# EAGLE design control (EAGLE 7.1.0)
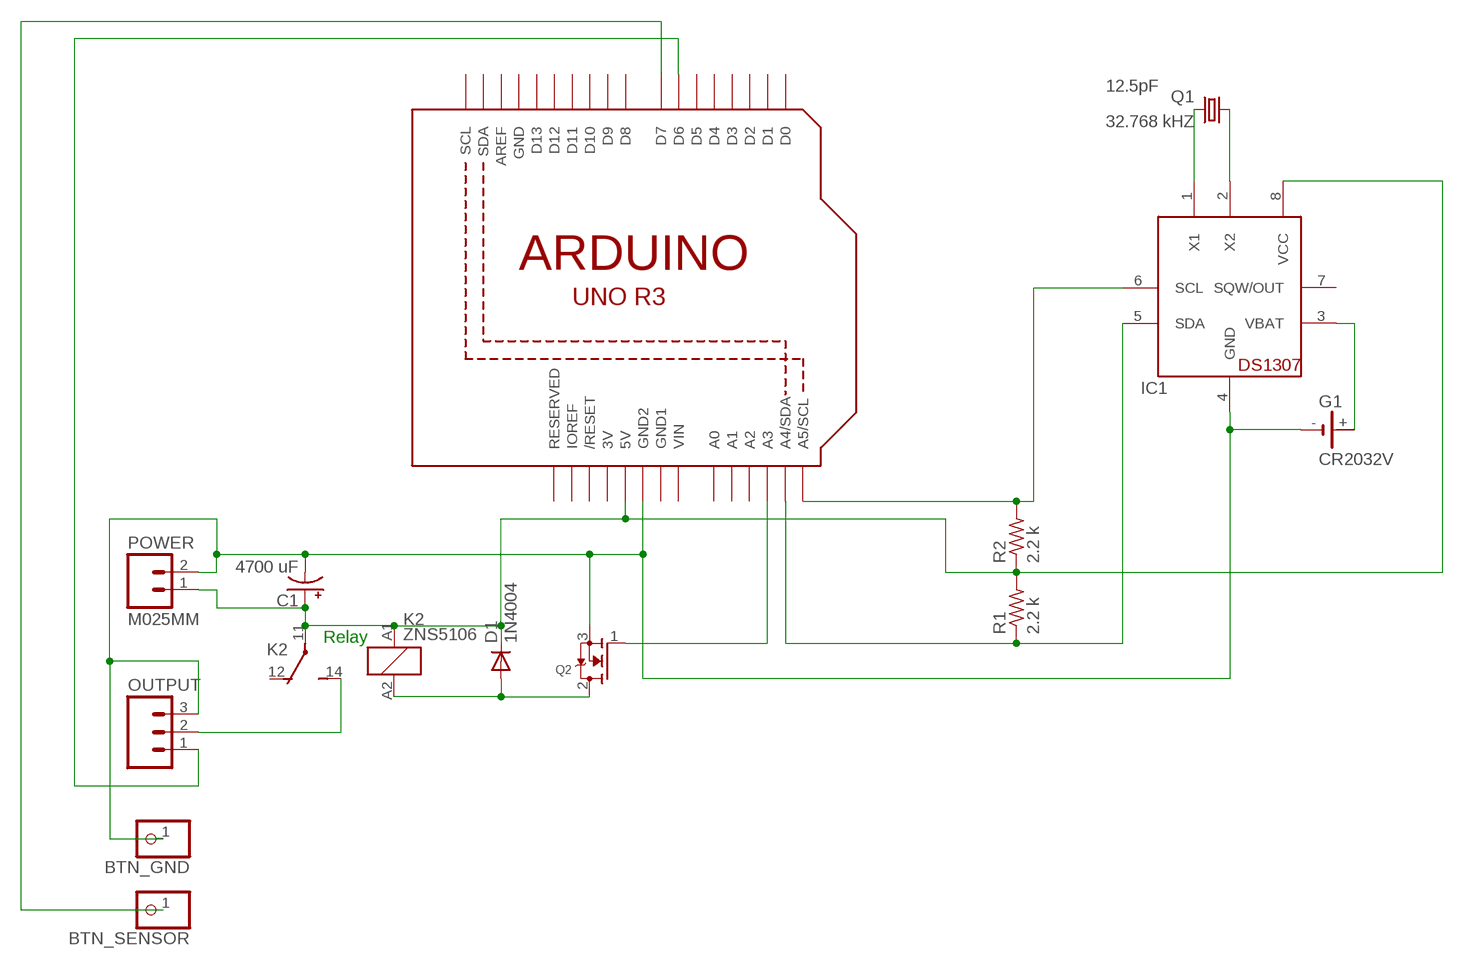
[diagram p0: schematic, sheet 1]

## Parts
BTN_GND  PINHD-1X1CB  [1X01-CLEANBIG]
BTN_SENSOR  PINHD-1X1CB  [1X01-CLEANBIG]
C1  4700 uF  CPOL-USE5-10.5  [E5-10,5]
D1  1N4004  [DO41-10]
G1  CR2032V  [CR2032V]
IC1  DS1307  [DIL08]
K2  ZNS5106  [ZN5]
OUTPUT  M03-SCREW-5MM  [SCREWTERMINAL-5MM-3]
POWER  M025MM  [SCREWTERMINAL-5MM-2]
Q1  32.768 kHZ  CRYSTALTC38H  [TC38H]
Q2  MOSFET-NGDS_TO220V  [TO220V]
R1  2.2 k  R-US_0207/10  [0207/10]
R2  2.2 k  R-US_0207/10  [0207/10]
U1  ARDUINOR3-BPLACE  [ARDUINOR3-BPLACE]

## Nets
N$1: BTN_GND.1 C1.- G1.- IC1.4(GND) OUTPUT.3 POWER.2 Q2.3(S) U1.GND2
N$2: IC1.1(X1) Q1.2
N$3: Q2.1(G) U1.A3
N$4: D1.A K2.A2 Q2.2(D)
N$5: K2.14(2:S) OUTPUT.2
N$6: OUTPUT.1 U1.D6
N$7: BTN_SENSOR.1 U1.D7
N$8: IC1.2(X2) Q1.1
N$11: G1.+ IC1.3(VBAT)
N$12: IC1.6(SCL) R2.2 U1.A5(A5/SCL)
N$13: IC1.5(SDA) R1.1 U1.A4(A4/SDA)
N$16: C1.+ D1.C IC1.8(VCC) K2.11(2:P) K2.A1 POWER.1 R1.2 R2.1 U1.5V
Unconnected: IC1.7(SQW/OUT) K2.12(2:O) U1.A0 U1.A1 U1.A2 U1.AREF U1.D0 U1.D1 U1.D2 U1.D3 U1.D4 U1.D5 U1.D8 U1.D9 U1.D10 U1.D11 U1.D12 U1.D13 U1.IOREF U1.RESERVED U1.RESET(/RESET) U1.SCL U1.SDA

## Notes on the sheet
- Relay

## Power pins joined to a net without a drawn wire
3V: U1.3V
GND: U1.GND
GND1: U1.GND1
VIN: U1.VIN

## Library data of the parts
BTN_GND BTN_SENSOR = adafruit:PINHD-1X1: Pin header 1x1 for 0.1" spacing With round pins
C1 = adafruit:CPOL-US: POLARIZED CAPACITOR, American symbol
D1 = adafruit:1N4004: DIODE General purpose 1N400x type rectifier (With bigger pads) http://www.ladyada.net/library/pcb/eaglelibrary.html
G1 = cadre:CR2032V: LI BATTERY Varta
IC1 = adafruit:DS1307: DS1307 Real time clock (RTC) with battery backup ability. Talk to it via i2c
K2 = relay:ZNS5*: Miniature Power PCB Relay SCHRACK 1pole 10 A Source: http://www.schrack.com/.. 5847.pdf; OC_FARNELL: unknown; OC_NEWARK: unknown
OUTPUT = SparkFun-Connectors:M03: Header 3 Standard 3-pin 0.1" header. Use with straight break away headers (SKU : PRT-00116), right angle break away headers (PRT-00553), swiss pins (PRT-00743), machine pins (PRT-00117), and female headers (PRT-00115). Molex polarized connector foot print use with SKU : PRT-08232 with associated crimp pins and housings.; STOREFRONT_ID: PRT-08433
POWER = SparkFun-Connectors:M02: Standard 2-pin 0.1" header. Use with - straight break away headers ( PRT-00116) - right angle break away headers (PRT-00553) - swiss pins (PRT-00743) - machine pins (PRT-00117) - female headers (PRT-00115) Molex polarized connector foot print use with: PRT-08233 with associated crimp pins and housings. 2.54_SCREWTERM for use with PRT-10571. 3.5mm Screw Terminal footprints for PRT-08084 5mm Screw Terminal footprints for use with PRT-08432; STOREFRONT_ID: PRT-08432
Q1 = adafruit:CRYSTAL: CRYSTAL; C: 12.5pF; OC_FARNELL: unknown; OC_NEWARK: unknown
Q2 = adafruit:MOSFET-N: N-Channel Mosfet 2N7002E - 60V 260mA SOT23 [Digikey: 2N7002ET1GOSTR-ND] - REEL BSH103 - 30V 850mA SOT23 [Digikey: 568-5013-1-ND]
R1 R2 = adafruit:R-US_: RESISTOR, American symbol
U1 = adafruit:ARDUINOR3: This is a new object for the new Arduino R3 - with extra pins that you may want to use (such as IOref, and duplicated A4/A5

## Board
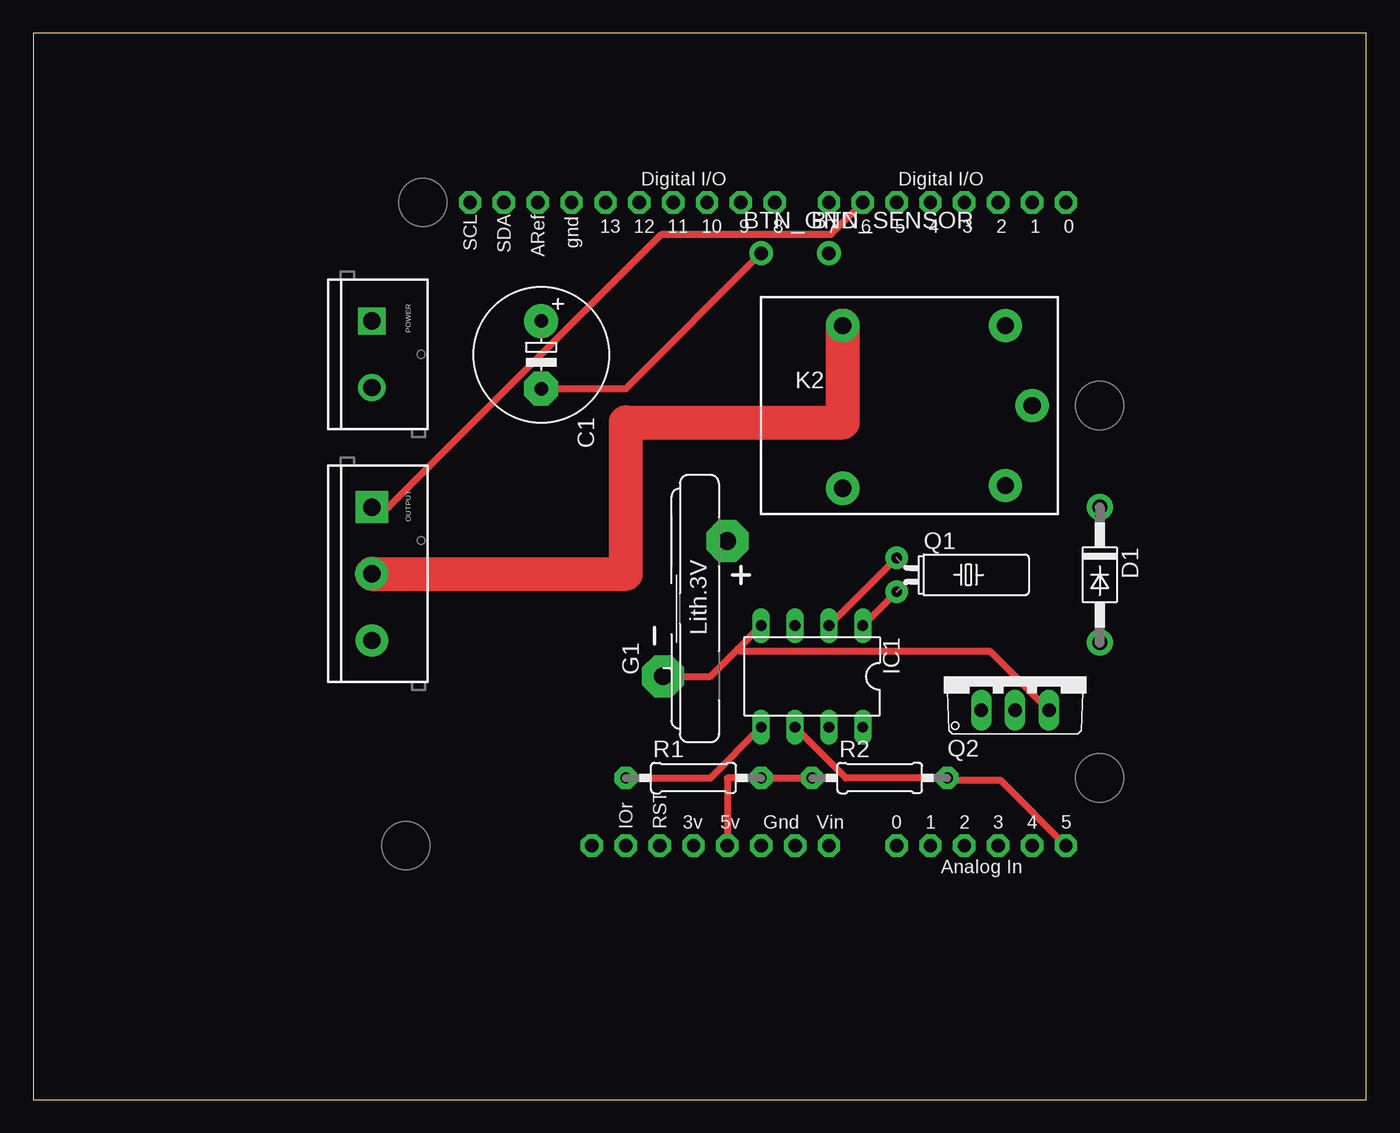
[diagram p1: board, top side]
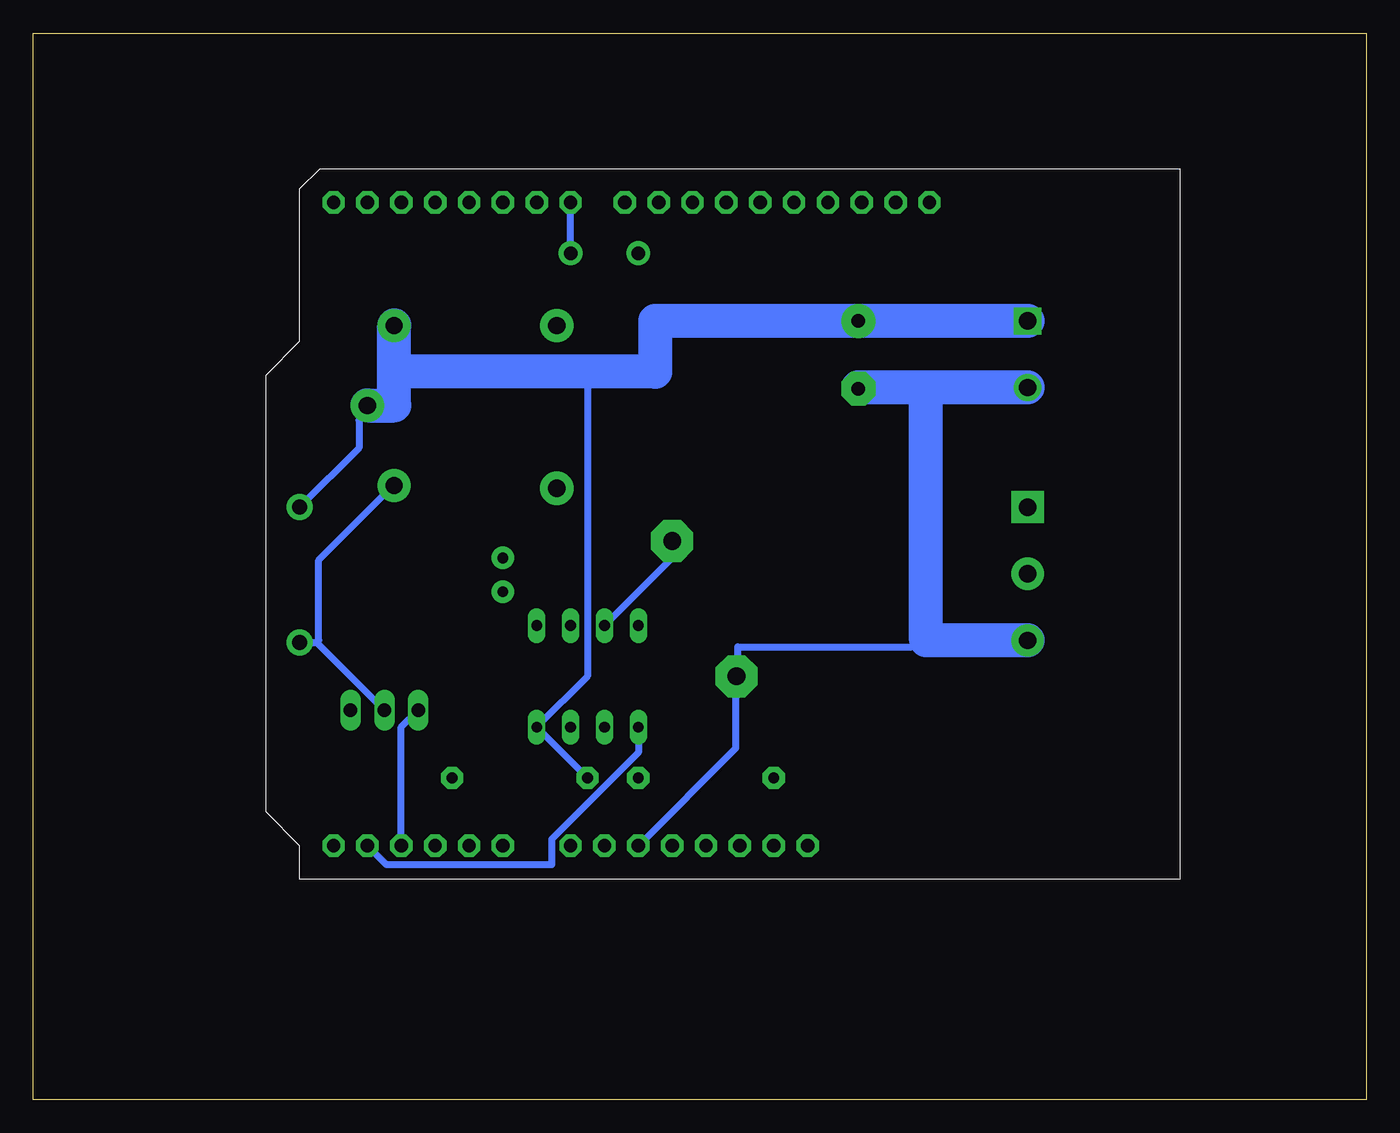
[diagram p2: board, bottom side, seen from below]

Size 100 x 80 mm. Coordinates in mm from the lower left corner, seen from the top.
Outline: 0,0 100,0 100,80 0,80 0,0
Copper layers (1*16): Top 0.035mm / dielectric 1.5mm / Bottom 0.035mm
Design rules "default *": minimum track width 20mil, minimum drill 24mil, track to track 8mil, track to pad 8mil, pad to pad 8mil, via to via 8mil, smd to smd 8mil, copper to edge 40mil, drill to drill 8mil, minimum pad ring 10mil, minimum via ring 8mil, stop-mask expansion 4mil, vias tented up to drill 0mil, thermal gap 10mil

### Footprints (pad centres in the part's own frame; a part is rotated, then mirrored left to right if it is on the bottom)
1X01-CLEANBIG = drill 1.016 pad 1.778: 1 0,0
E5-10,5 = drill 1.016 pad 2.54: + -2.54,0 | drill 1.016 pad 2.54 octagon: - 2.54,0
DO41-10 = drill 1.118 pad 1.93: A 5.08,0; C -5.08,0
CR2032V = drill 1.321 pad 3.15 octagon: + -2.54,-5.08; - 2.286,5.08
DIL08 = drill 0.813 long: 1 -3.81,-3.81; 2 -1.27,-3.81; 3 1.27,-3.81; 4 3.81,-3.81; 5 3.81,3.81; 6 1.27,3.81; 7 -1.27,3.81; 8 -3.81,3.81
ZN5 = drill 1.3 pad 2.5: 11 8.89,0; 12 -5.31,-6.2; 14 -5.31,6; A1 6.89,6; A2 6.89,-6
SCREWTERMINAL-5MM-3 = drill 1.3 pad 2.413 square: 1 0,0 | drill 1.3 pad 2.413: 2 5,0; 3 10,0
SCREWTERMINAL-5MM-2 = drill 1.3 pad 2.032 square: 1 0,0 | drill 1.3 pad 2.032: 2 5,0
TC38H = drill 0.813 pad 1.676: 1 -1.27,0; 2 1.27,0
TO220V = drill 1.016 long: 1 -2.54,-2.54; 2 0,-2.54; 3 2.54,-2.54
0207/10 = drill 0.813 pad 1.676 octagon: 1 -5.08,0; 2 5.08,0
ARDUINOR3-BPLACE = drill 1 pad 1.676 octagon: 3V 35.56,2.54; 5V 38.1,2.54; A0 50.8,2.54; A1 53.34,2.54; A2 55.88,2.54; A3 58.42,2.54; A4 60.96,2.54; A5 63.5,2.54; AREF 23.876,50.8; D0 63.5,50.8; D1 60.96,50.8; D2 58.42,50.8; D3 55.88,50.8; D4 53.34,50.8; D5 50.8,50.8; D6 48.26,50.8; D7 45.72,50.8; D8 41.656,50.8; D9 39.116,50.8; D10 36.576,50.8; D11 34.036,50.8; D12 31.496,50.8; D13 28.956,50.8; GND 26.416,50.8; GND1 43.18,2.54; GND2 40.64,2.54; IOREF 30.48,2.54; RESERVED 27.94,2.54; RESET 33.02,2.54; SCL 18.796,50.8; SDA 21.336,50.8; VIN 45.72,2.54

### Placement (x,y rotation side)
BTN_GND  54.61,63.5 0 top
BTN_SENSOR  59.69,63.5 0 top
C1  38.1,55.88 270 top
D1  80.01,39.37 270 top
G1  49.53,36.83 180 top
IC1  58.42,31.75 180 top
K2  66.04,52.07 0 top
OUTPUT  25.4,44.45 270 top
POWER  25.4,58.42 270 top
Q1  64.77,39.37 270 top
Q2  73.66,31.75 0 top
R1  49.53,24.13 0 top
R2  63.5,24.13 0 top
U1  13.97,16.51 0 top

### Tracks (layer width: path | path; a pad name or v marks a point on that pad's centre or on a via)
N$1
  Top 0.508: BTN_GND.1 44.45,53.34 C1.- | 52.86,33.81 50.8,31.75 G1.- | 52.86,33.81 IC1.4 | Q2.3 71.75,33.66 53.02,33.66 52.86,33.81
  Bottom 0.508: 31.91,53.42 31.91,53.5 33.02,53.34 | U1.GND2 47.31,26.35 47.31,31.75 G1.- 47.15,31.91 47.15,33.97 34.13,33.97 33.02,34.45
  Bottom 2.54: POWER.2 31.91,53.42 38.1,53.42 C1.- | OUTPUT.3 33.02,34.45 33.02,53.34
N$2
  Top 0.508: Q1.2 IC1.1
N$3
  Bottom 0.508: Q2.1 72.39,27.94 U1.A3
N$4
  Bottom 0.508: 78.74,34.29 Q2.2 | D1.A 78.74,34.29 | K2.A2 73.03,46.04 78.58,40.48 78.58,34.45 78.74,34.29
N$5
  Top 2.54: OUTPUT.2 44.45,39.45 44.45,50.8 60.73,50.8 K2.14
N$6
  Top 0.508: U1.D6 59.85,64.93 47.15,64.93 26.67,44.45 OUTPUT.1
N$7
  Bottom 0.508: BTN_SENSOR.1 U1.D7
N$8
  Top 0.508: Q1.1 IC1.2
N$11
  Bottom 0.508: IC1.3 52.07,40.64 G1.+
N$12
  Top 0.508: IC1.6 60.96,24.13 R2.2 68.74,23.97 72.55,23.97 U1.A5
N$13
  Top 0.508: IC1.5 50.8,24.13 R1.1
  Bottom 0.508: U1.A4 73.5,17.62 61.12,17.62 61.12,19.53 54.61,26.04 IC1.5
N$16
  Top 0.508: U1.5V 52.07,24.13 R1.2 R2.1
  Bottom 0.508: R2.1 IC1.8 58.42,31.75 58.42,54.61 | D1.C 75.56,48.9 75.56,50.96 K2.11
  Bottom 2.54: POWER.1 C1.+ 53.34,58.42 53.34,54.61 58.42,54.61 72.93,54.61 | 72.93,54.61 K2.A1 | K2.11 72.93,52.07 72.93,54.61